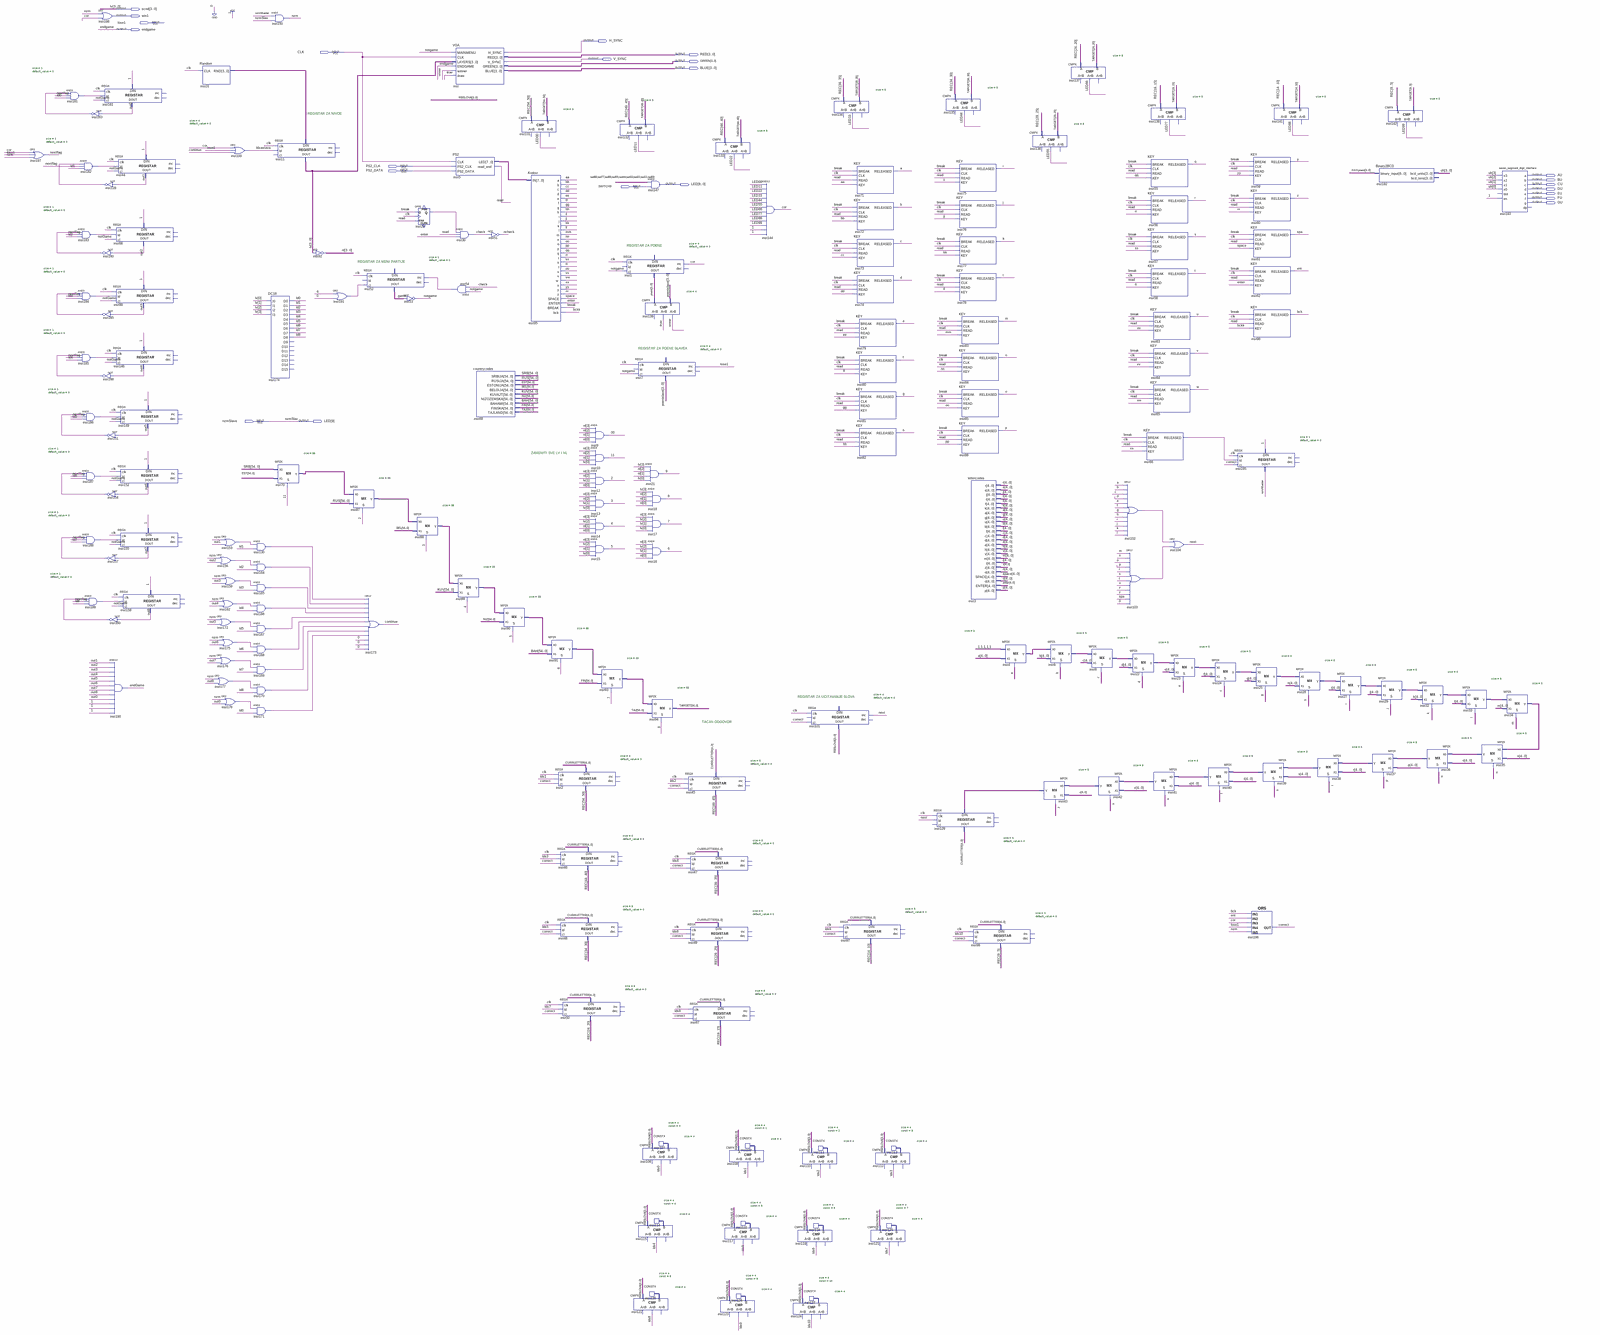
[diagram p0: schematic sheet, whole]
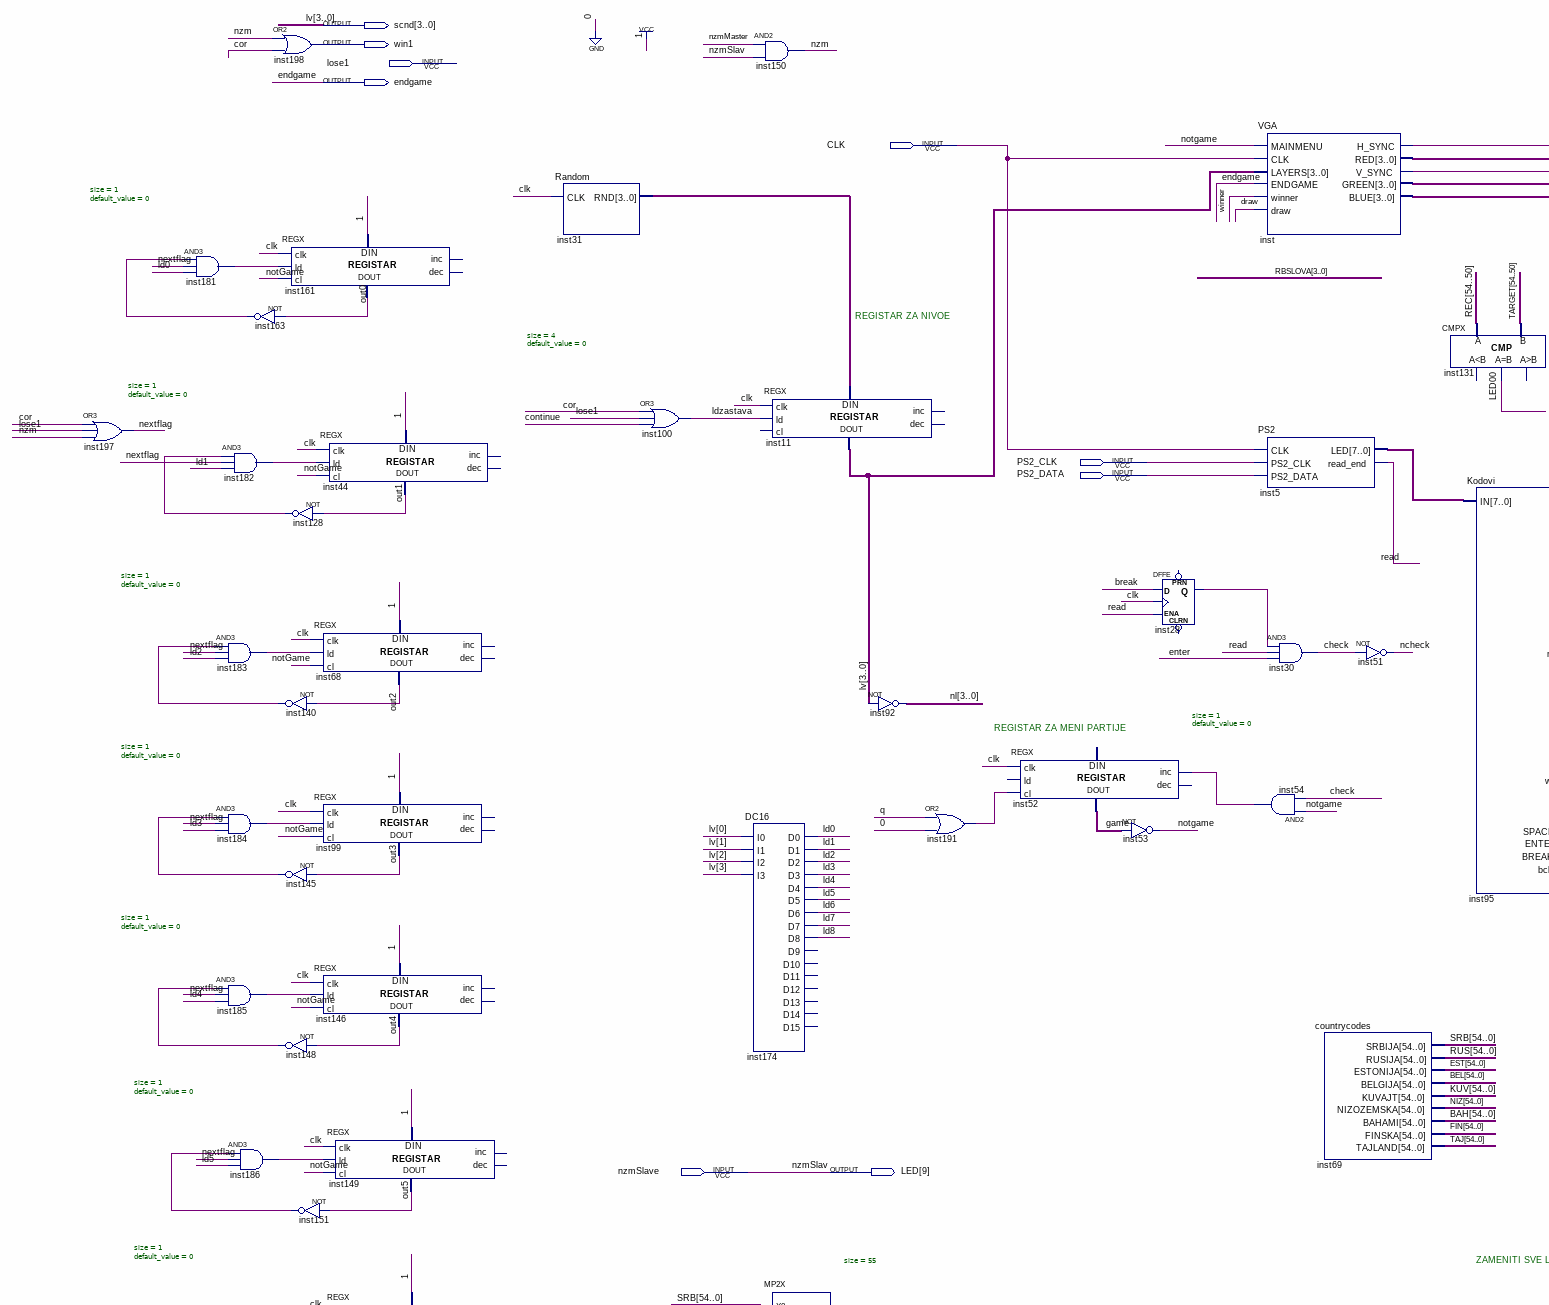
[diagram p1: schematic sheet, upper left part]
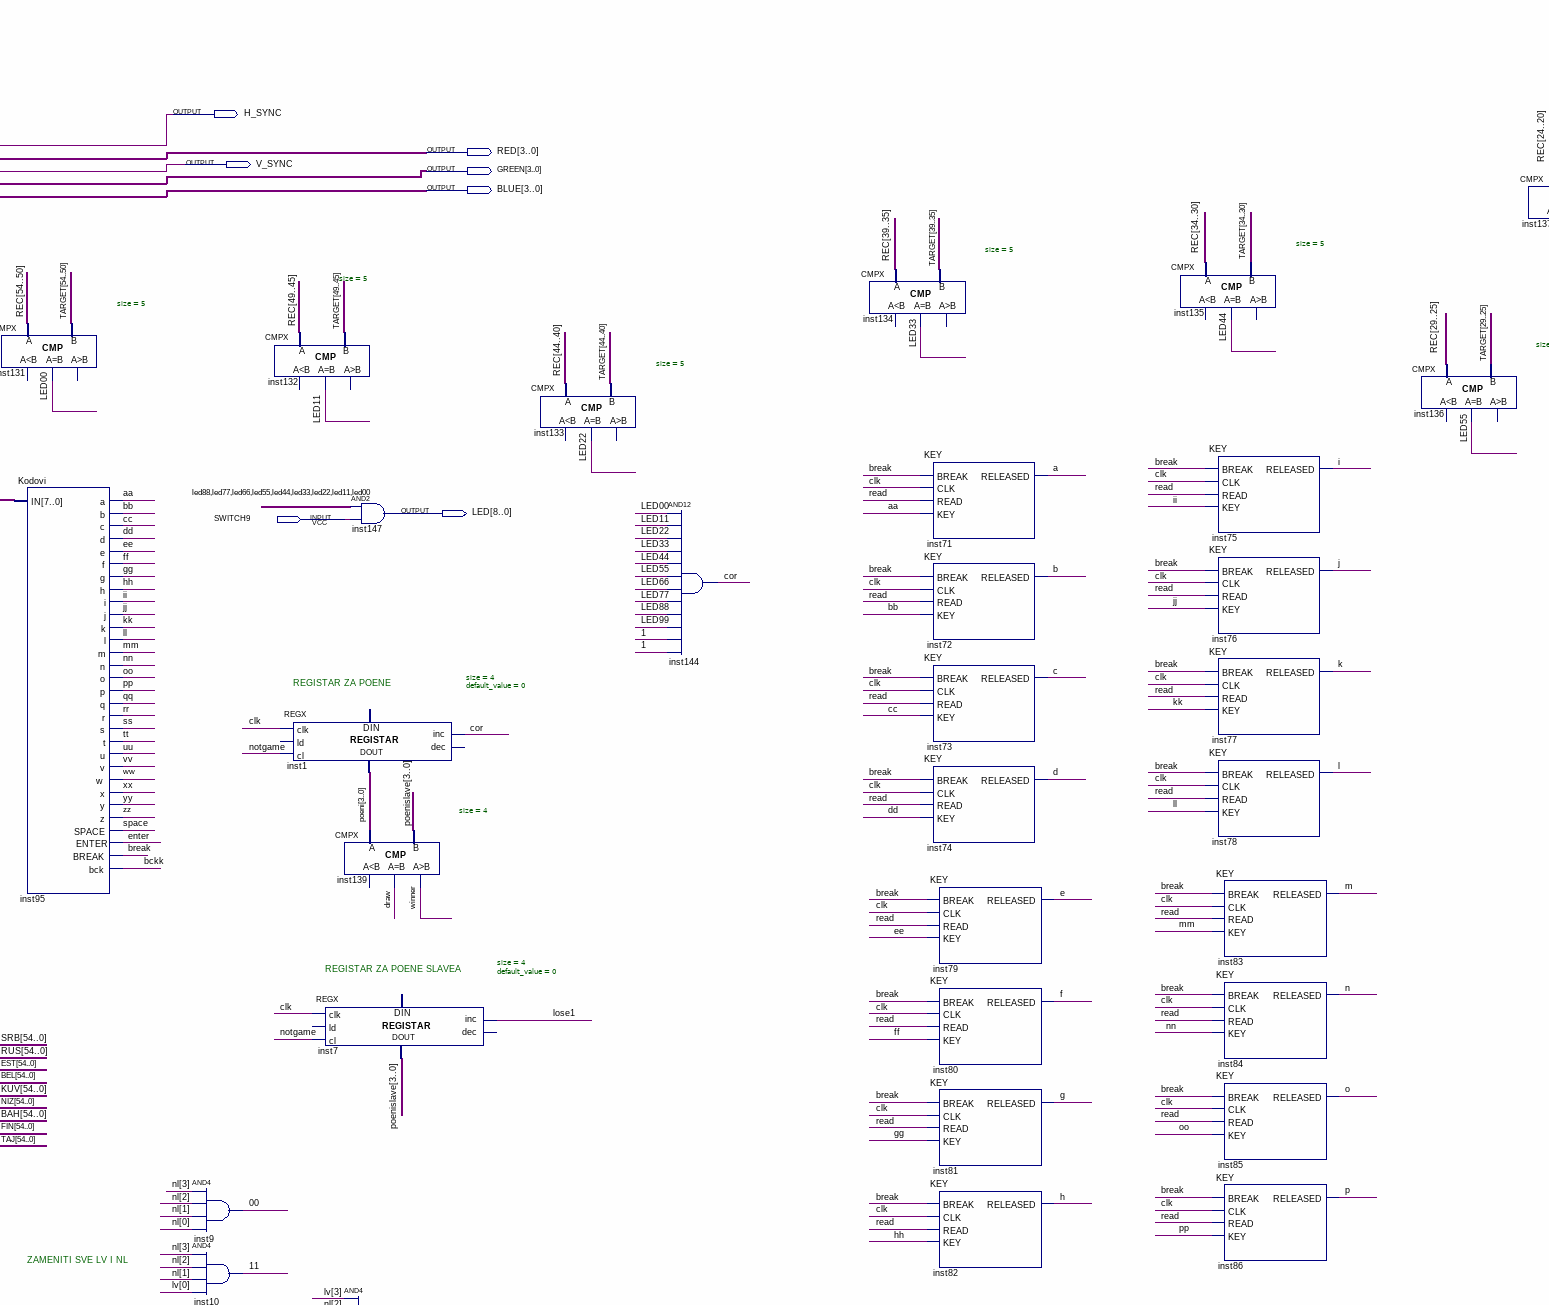
[diagram p2: schematic sheet, upper centre part]
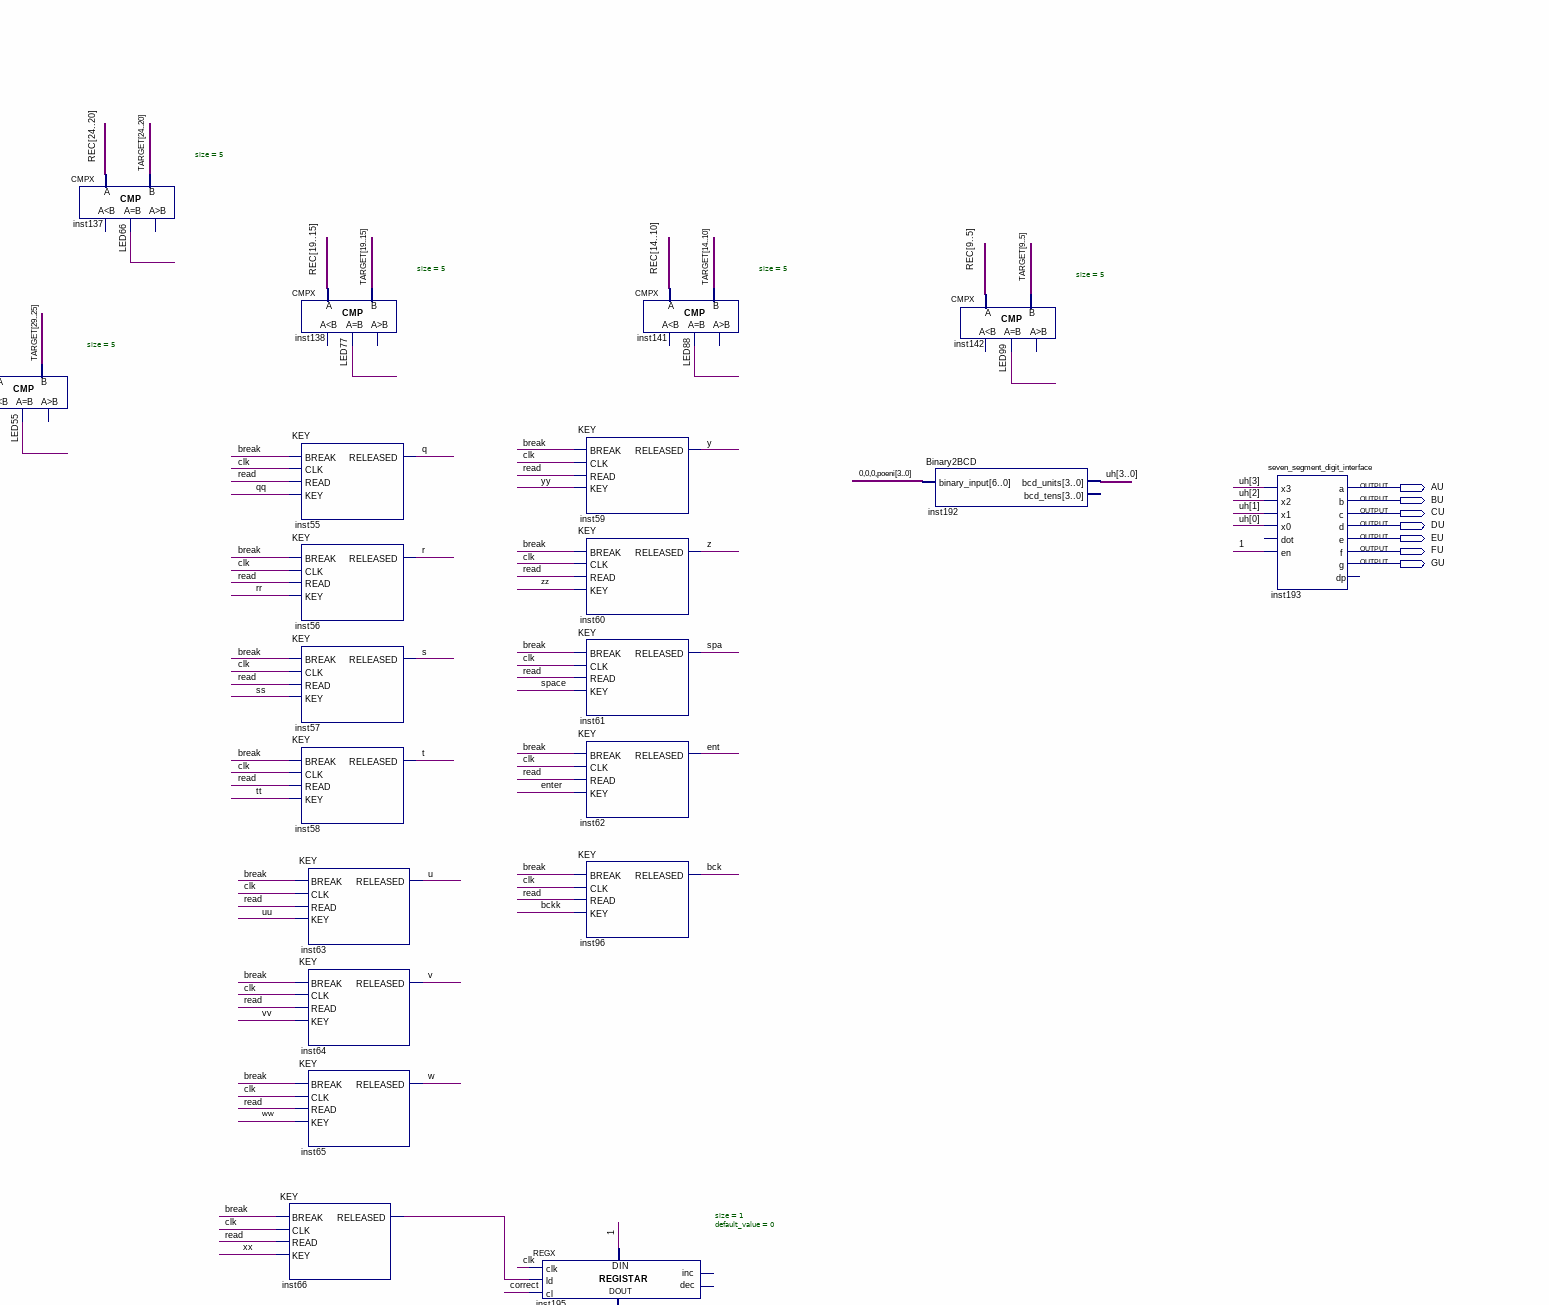
[diagram p3: schematic sheet, upper right part]
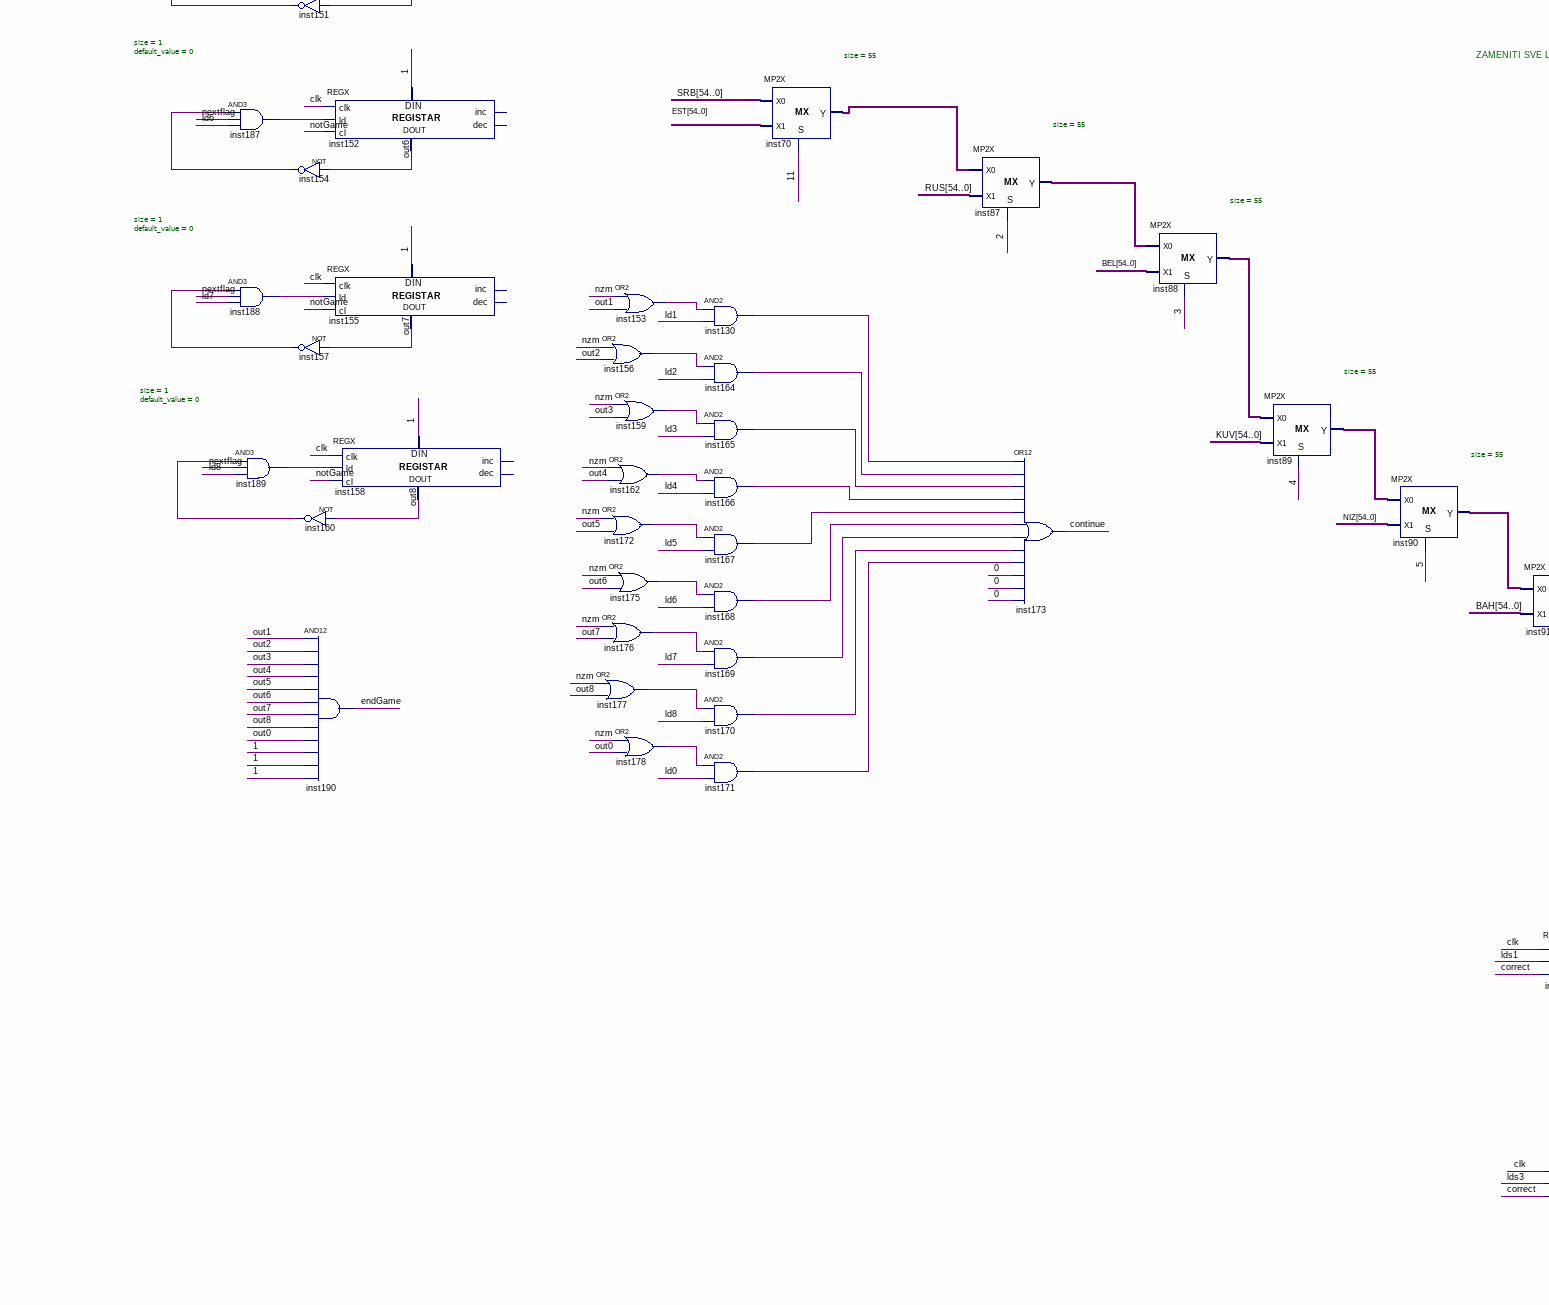
[diagram p4: schematic sheet, middle left part]
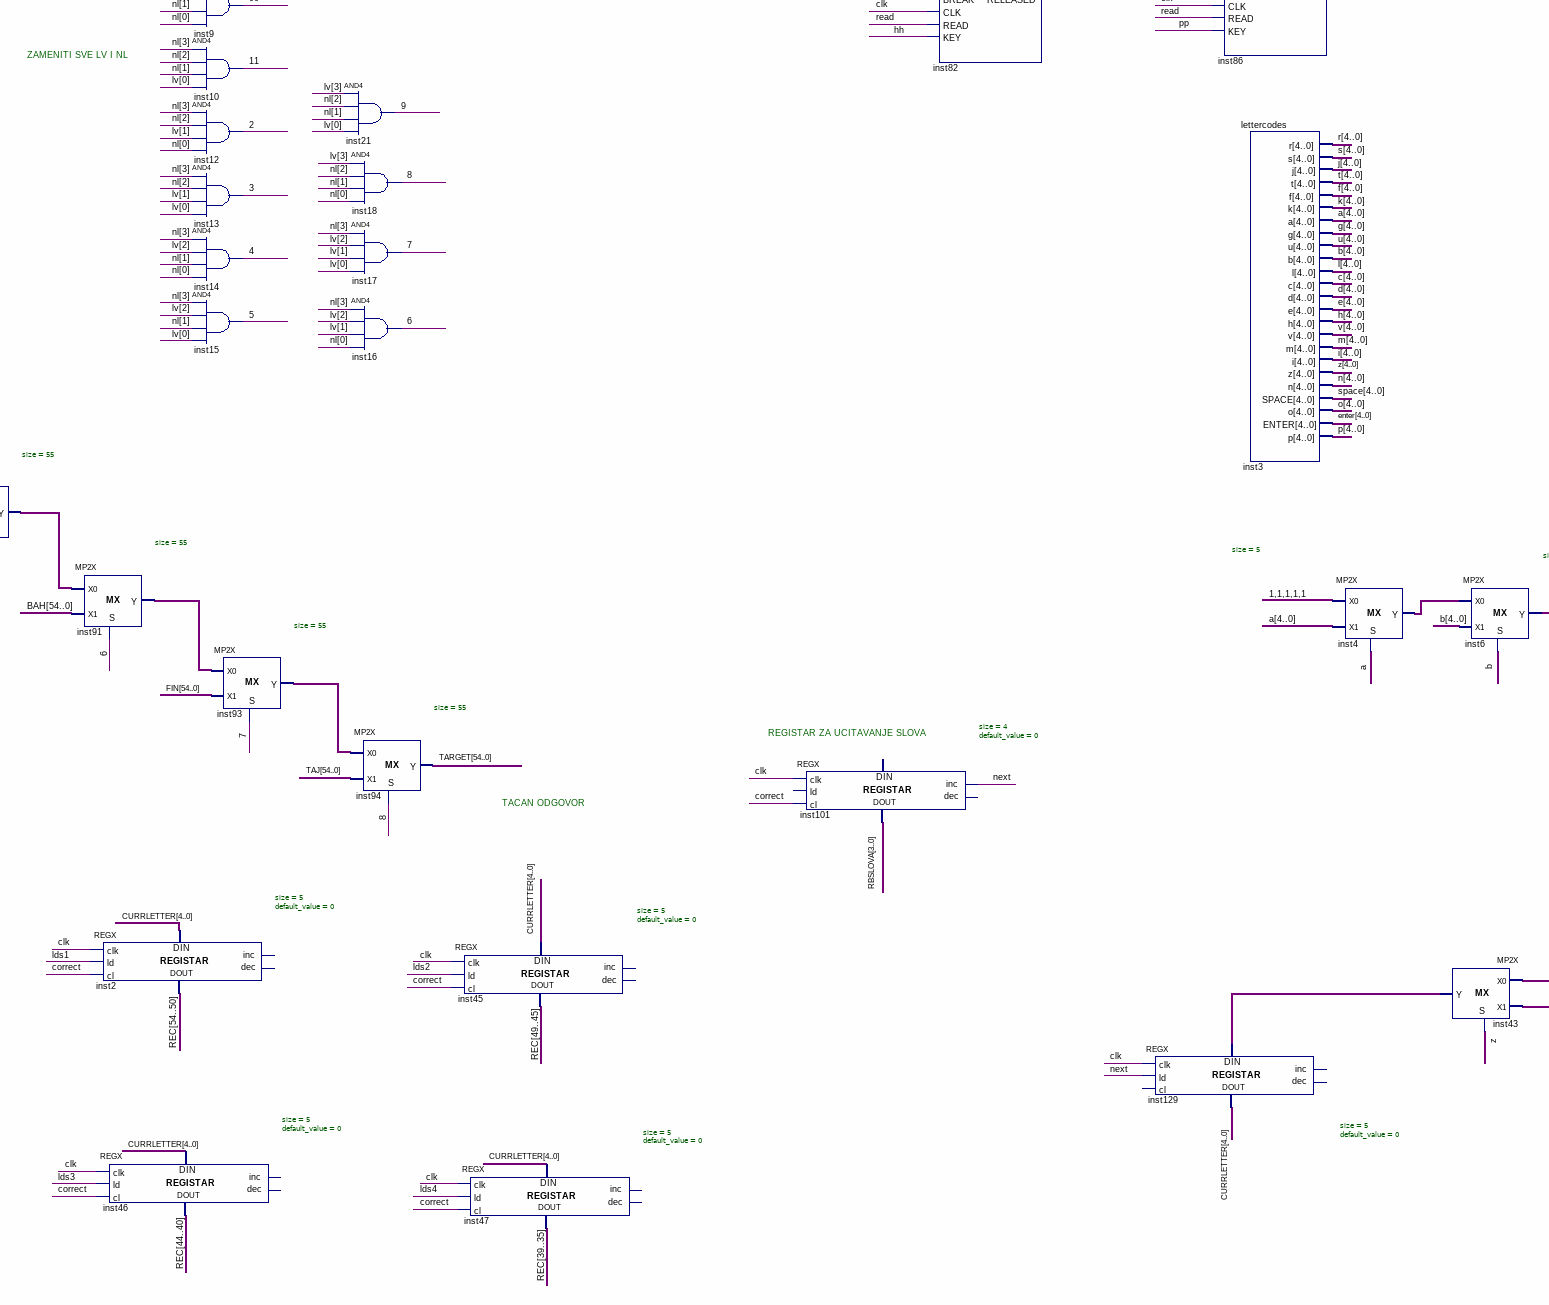
[diagram p5: schematic sheet, middle centre part]
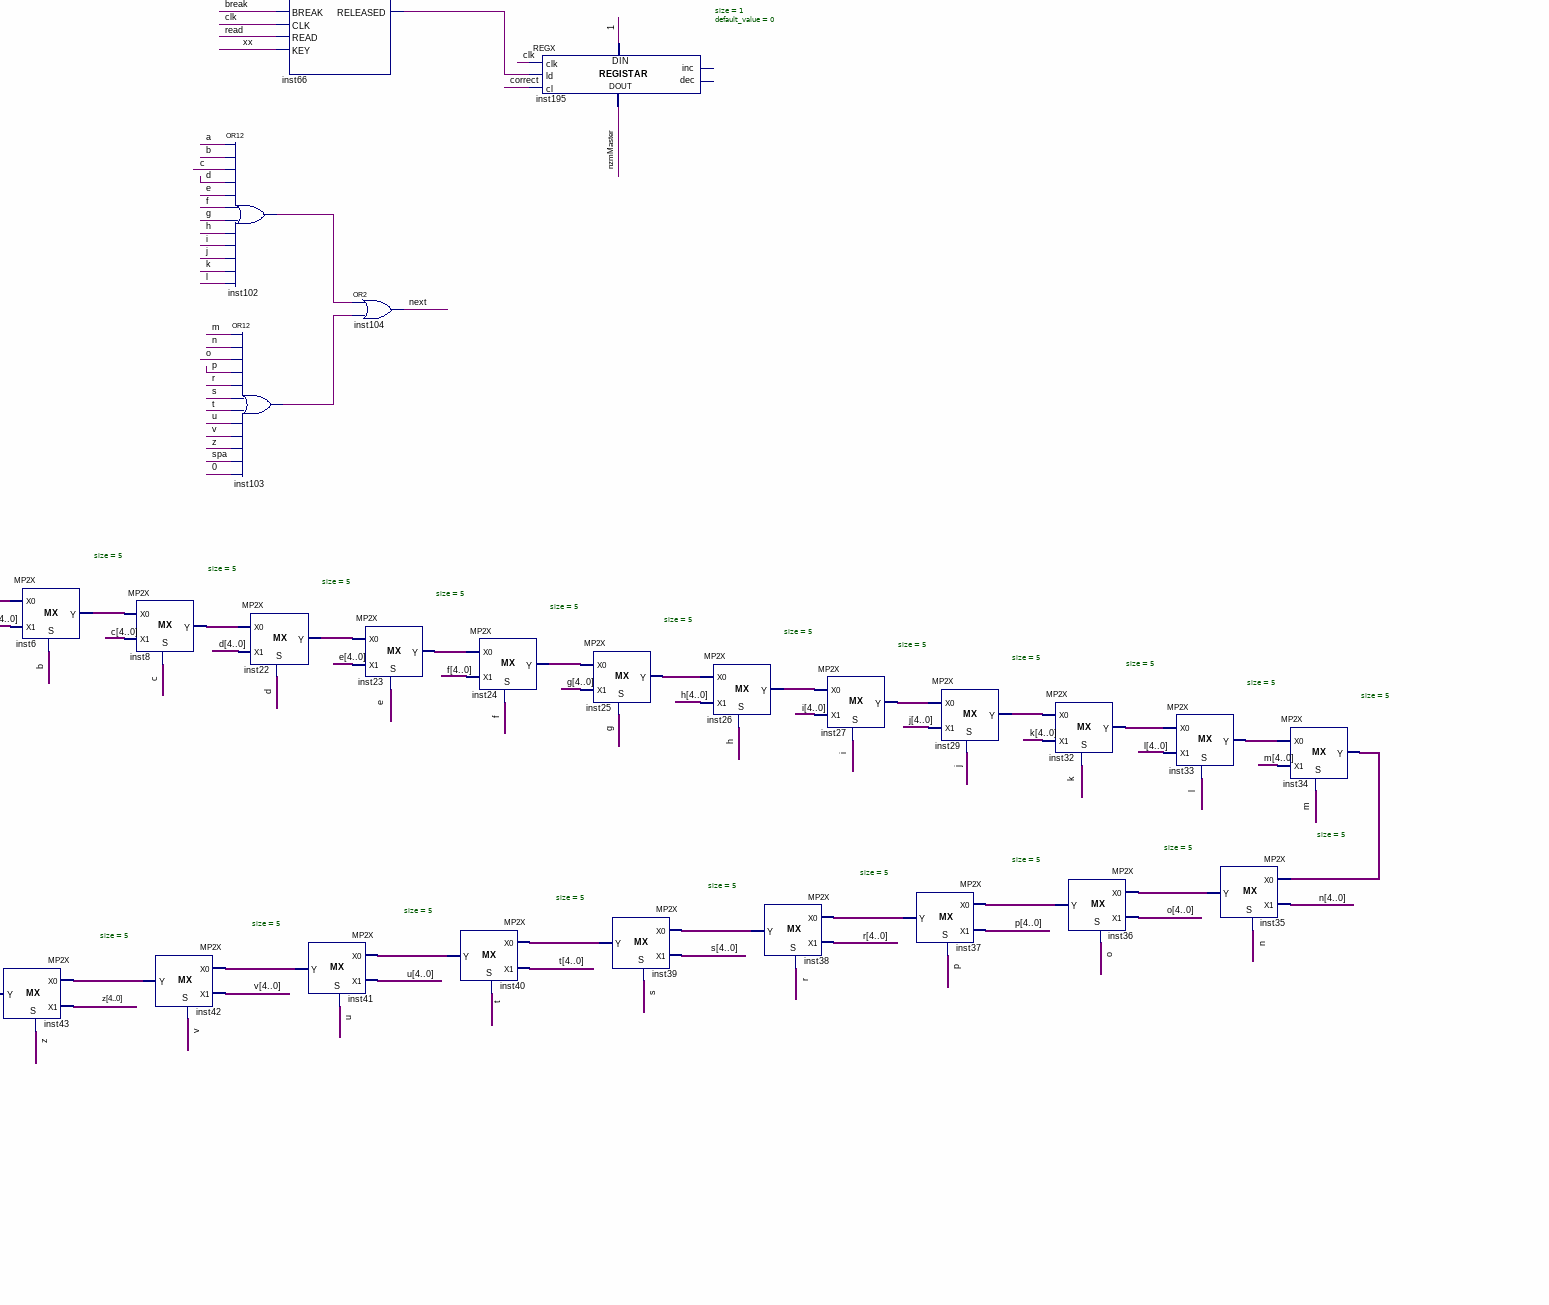
[diagram p6: schematic sheet, middle right part]
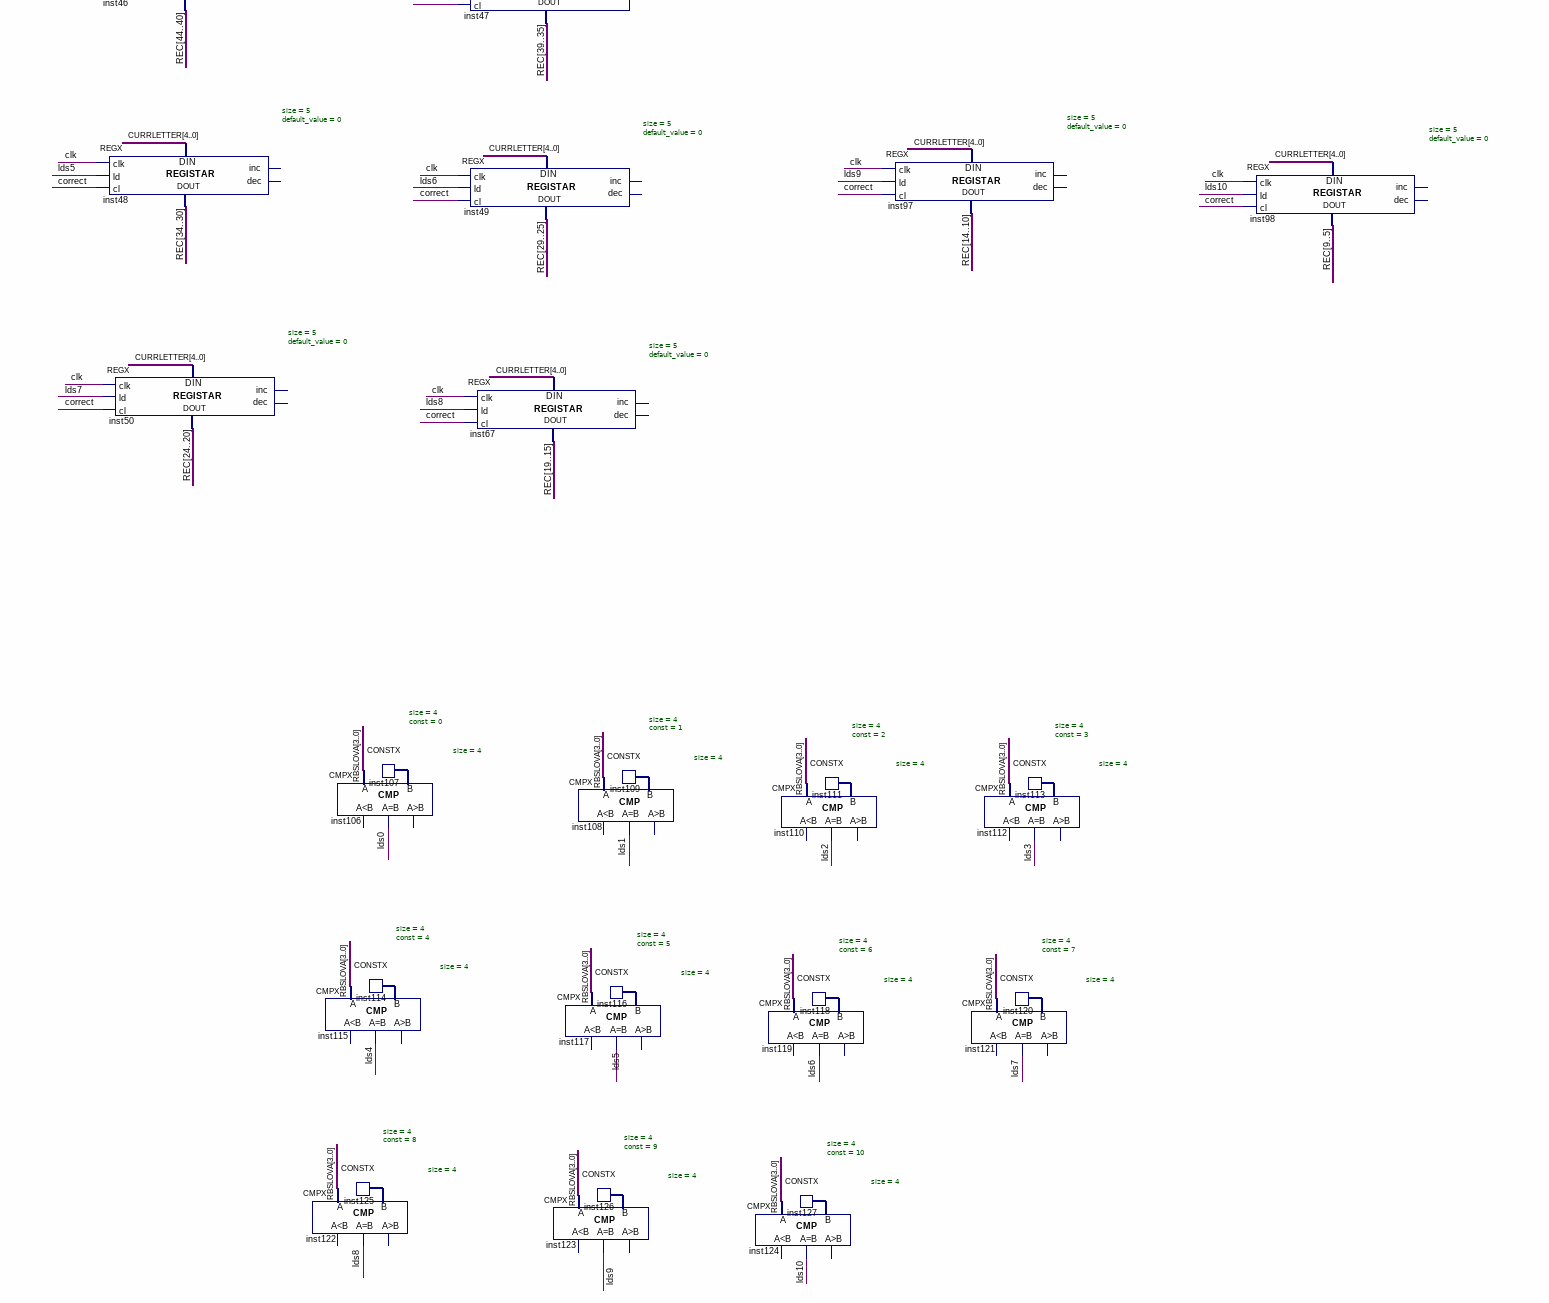
[diagram p7: schematic sheet, lower centre part]
// Quartus schematic FlagQuiz.bdf as structural Verilog: 192 symbols, 23 pins
module FlagQuiz (
  input  lose1,
  input  CLK,
  input  PS2_CLK,
  input  PS2_DATA,
  input  SWITCH9,
  input  nzmSlave,
  output [3:0] scnd,
  output win1,
  output endgame,
  output H_SYNC,
  output [3:0] RED,
  output V_SYNC,
  output [3:0] GREEN,
  output [3:0] BLUE,
  output AU,
  output BU,
  output [9:0] LED,
  output CU,
  output DU,
  output EU,
  output FU,
  output GU
);

  wire \00 , \2 , \3 , \4 , \5 , \6 , \7 , \8 , \9 , \11 , a_1bit, aa, b_1bit, bb, bck, bckk, \break ,
       c_1bit, cc, check, \continue , cor, correct, d_1bit, dd, draw, e_1bit, ee, ent, enter_1bit, f_1bit,
       ff, g_1bit, game, gg, h_1bit, hh, i_1bit, ii, inst28_q, inst54_out, inst66_released, inst102_out,
       inst103_out, inst128_out, inst130_out, inst140_out, inst145_out, inst148_out, inst151_out,
       inst153_out, inst154_out, inst156_out, inst157_out, inst159_out, inst160_out, inst162_out,
       inst163_out, inst164_out, inst165_out, inst166_out, inst167_out, inst168_out, inst169_out,
       inst170_out, inst171_out, inst172_out, inst175_out, inst176_out, inst177_out, inst178_out,
       inst181_out, inst182_out, inst183_out, inst184_out, inst185_out, inst186_out, inst187_out,
       inst188_out, inst189_out, inst191_out, j_1bit, jj, k_1bit, kk, l_1bit, ld0, ld1, ld2, ld3, ld4, ld5,
       ld6, ld7, ld8, lds0, lds1, lds2, lds3, lds4, lds5, lds6, lds7, lds8, lds9, lds10, ldzastava, LED00,
       LED11, LED22, LED33, LED44, LED55, LED66, LED77, LED88, LED99, ll, m_1bit, mm, n_1bit, ncheck, next,
       nextflag, nn, notgame, nzm, nzmMaster, o_1bit, oo, out0, out1, out2, out3, out4, out5, out6, out7,
       out8, p_1bit, pp, q, qq, r_1bit, read, rr, s_1bit, spa, space_1bit, ss, t_1bit, tt, u_1bit, uu,
       v_1bit, vv, w, winner, ww, xx, y, yy, z_1bit, zz;
  wire [3:0] inst31_rnd, inst107_data, inst109_data, inst111_data, inst113_data, inst114_data, inst116_data,
       inst118_data, inst120_data, inst125_data, inst126_data, inst127_data, nl, poeni, poenislave, RBSLOVA,
       uh;
  wire [4:0] a, b, c, CURRLETTER, d, e, enter, f, g, h, i, inst4_y, inst6_y, inst8_y, inst22_y, inst23_y,
       inst24_y, inst25_y, inst26_y, inst27_y, inst29_y, inst32_y, inst33_y, inst34_y, inst35_y, inst36_y,
       inst37_y, inst38_y, inst39_y, inst40_y, inst41_y, inst42_y, inst43_y, j, k, l, m, n, o, p, r, s,
       space, t, u, v, z;
  wire [7:0] inst5_led;
  wire [54:0] BAH, BEL, EST, FIN, inst70_y, inst87_y, inst88_y, inst89_y, inst90_y, inst91_y, inst93_y, KUV,
       NIZ, RUS, SRB, TAJ, TARGET;
  wire [54:5] REC;

  or inst197 (nextflag, cor, lose1, nzm);
  and inst181 (inst181_out, inst163_out, nextflag, ld0);
  not inst163 (inst163_out, out0);
  and inst182 (inst182_out, inst128_out, nextflag, ld1);
  and inst183 (inst183_out, inst140_out, nextflag, ld2);
  and inst184 (inst184_out, inst145_out, nextflag, ld3);
  and inst185 (inst185_out, inst148_out, nextflag, ld4);
  and inst186 (inst186_out, inst151_out, nextflag, ld5);
  and inst187 (inst187_out, inst154_out, nextflag, ld6);
  and inst188 (inst188_out, inst157_out, nextflag, ld7);
  and inst189 (inst189_out, inst160_out, nextflag, ld8);
  or inst198 (win1, nzm, cor);
  REGX #(.size(1), .default_value(0)) inst161 (
    .clk(CLK), .ld(inst181_out), .cl(notgame), .data_in(1'b1), .data_out(out0));  // open: inc, dec
  not inst128 (inst128_out, out1);
  not inst140 (inst140_out, out2);
  not inst145 (inst145_out, out3);
  not inst148 (inst148_out, out4);
  not inst151 (inst151_out, out5);
  not inst154 (inst154_out, out6);
  not inst157 (inst157_out, out7);
  not inst160 (inst160_out, out8);
  REGX #(.size(1), .default_value(0)) inst44 (
    .clk(CLK), .ld(inst182_out), .cl(notgame), .data_in(1'b1), .data_out(out1));  // open: inc, dec
  REGX #(.size(1), .default_value(0)) inst68 (
    .clk(CLK), .ld(inst183_out), .cl(notgame), .data_in(1'b1), .data_out(out2));  // open: inc, dec
  REGX #(.size(1), .default_value(0)) inst99 (
    .clk(CLK), .ld(inst184_out), .cl(notgame), .data_in(1'b1), .data_out(out3));  // open: inc, dec
  REGX #(.size(1), .default_value(0)) inst146 (
    .clk(CLK), .ld(inst185_out), .cl(notgame), .data_in(1'b1), .data_out(out4));  // open: inc, dec
  REGX #(.size(1), .default_value(0)) inst149 (
    .clk(CLK), .ld(inst186_out), .cl(notgame), .data_in(1'b1), .data_out(out5));  // open: inc, dec
  REGX #(.size(1), .default_value(0)) inst152 (
    .clk(CLK), .ld(inst187_out), .cl(notgame), .data_in(1'b1), .data_out(out6));  // open: inc, dec
  REGX #(.size(1), .default_value(0)) inst155 (
    .clk(CLK), .ld(inst188_out), .cl(notgame), .data_in(1'b1), .data_out(out7));  // open: inc, dec
  REGX #(.size(1), .default_value(0)) inst158 (
    .clk(CLK), .ld(inst189_out), .cl(notgame), .data_in(1'b1), .data_out(out8));  // open: inc, dec
  and inst190 (endgame, out1, out2, out3, out4, out5, out6, out7, out8, out0, 1'b1, 1'b1, 1'b1);
  Random inst31 (.CLK(CLK), .RND(inst31_rnd));
  or inst156 (inst156_out, nzm, out2);
  or inst172 (inst172_out, nzm, out5);
  or inst176 (inst176_out, nzm, out7);
  or inst177 (inst177_out, nzm, out8);
  or inst100 (ldzastava, cor, lose1, \continue );
  or inst153 (inst153_out, nzm, out1);
  or inst159 (inst159_out, nzm, out3);
  or inst162 (inst162_out, nzm, out4);
  or inst175 (inst175_out, nzm, out6);
  or inst178 (inst178_out, nzm, out0);
  and inst130 (inst130_out, inst153_out, ld1);
  and inst164 (inst164_out, inst156_out, ld2);
  and inst165 (inst165_out, inst159_out, ld3);
  and inst166 (inst166_out, inst162_out, ld4);
  and inst167 (inst167_out, inst172_out, ld5);
  and inst168 (inst168_out, inst175_out, ld6);
  and inst169 (inst169_out, inst176_out, ld7);
  and inst170 (inst170_out, inst177_out, ld8);
  and inst171 (inst171_out, inst178_out, ld0);
  and inst150 (nzm, nzmMaster, nzmSlave);
  DC16 inst174 (
    .I0(scnd[0]), .I1(scnd[1]), .I2(scnd[2]), .I3(scnd[3]), .D0(ld0), .D1(ld1), .D2(ld2), .D3(ld3), .D4(ld4),
    .D5(ld5), .D6(ld6), .D7(ld7), .D8(ld8));  // open: D9, D10, D11, D12, D13, D14, D15
  REGX #(.size(4), .default_value(0)) inst11 (
    .clk(CLK), .ld(ldzastava), .data_in(inst31_rnd), .data_out(scnd));  // open: cl, inc, dec
  MP2X #(.size(55)) inst70 (.S(\11 ), .X0(SRB), .X1(EST), .Y(inst70_y));
  assign nl = ~scnd;  // NOT inst92, 4 bits wide
  or inst191 (inst191_out, q, 1'b0);
  REGX #(.size(1), .default_value(0)) inst52 (
    .clk(CLK), .cl(inst191_out), .inc(inst54_out), .data_out(game));  // open: ld, dec, data_in
  MP2X #(.size(55)) inst87 (.S(\2 ), .X0(inst70_y), .X1(RUS), .Y(inst87_y));
  or inst173 (\continue , inst130_out, inst164_out, inst165_out, inst166_out, inst167_out, inst168_out, inst169_out, inst170_out, inst171_out, 1'b0, 1'b0, 1'b0);
  DFFE inst28 (.D(\break ), .CLK(CLK), .ENA(read), .Q(inst28_q));  // open: PRN, CLRN
  not inst53 (notgame, game);
  MP2X #(.size(55)) inst88 (.S(\3 ), .X0(inst87_y), .X1(BEL), .Y(inst88_y));
  VGA inst (
    .MAINMENU(notgame), .CLK(CLK), .LAYERS(scnd), .ENDGAME(endgame), .winner(winner), .draw(draw),
    .H_SYNC(H_SYNC), .RED(RED), .V_SYNC(V_SYNC), .GREEN(GREEN), .BLUE(BLUE));
  PS2 inst5 (.CLK(CLK), .PS2_CLK(PS2_CLK), .PS2_DATA(PS2_DATA), .LED(inst5_led), .read_end(read));
  and inst54 (inst54_out, notgame, check);
  MP2X #(.size(55)) inst89 (.S(\4 ), .X0(inst88_y), .X1(KUV), .Y(inst89_y));
  and inst30 (check, inst28_q, read, enter_1bit);
  countrycodes inst69 (
    .SRBIJA(SRB), .RUSIJA(RUS), .ESTONIJA(EST), .BELGIJA(BEL), .KUVAJT(KUV), .NIZOZEMSKA(NIZ), .BAHAMI(BAH),
    .FINSKA(FIN), .TAJLAND(TAJ));
  not inst51 (ncheck, check);
  MP2X #(.size(55)) inst90 (.S(\5 ), .X0(inst89_y), .X1(NIZ), .Y(inst90_y));
  CMPX #(.size(5)) inst131 (.A(REC[54:50]), .B(TARGET[54:50]), .eq(LED00));  // open: ls, gr
  Kodovi inst95 (
    .IN(inst5_led), .a(aa), .b(bb), .c(cc), .d(dd), .e(ee), .f(ff), .g(gg), .h(hh), .i(ii), .j(jj), .k(kk),
    .l(ll), .m(mm), .n(nn), .o(oo), .p(pp), .q(qq), .r(rr), .s(ss), .t(tt), .u(uu), .v(vv), .w(ww), .x(xx),
    .y(yy), .z(zz), .SPACE(space_1bit), .ENTER(enter_1bit), .BREAK(\break ), .bck(bckk));
  MP2X #(.size(55)) inst91 (.S(\6 ), .X0(inst90_y), .X1(BAH), .Y(inst91_y));
  REGX #(.size(5), .default_value(0)) inst2 (
    .clk(CLK), .ld(lds1), .cl(correct), .data_in(CURRLETTER), .data_out(REC[54:50]));  // open: inc, dec
  REGX #(.size(5), .default_value(0)) inst46 (
    .clk(CLK), .ld(lds3), .cl(correct), .data_in(CURRLETTER), .data_out(REC[44:40]));  // open: inc, dec
  REGX #(.size(5), .default_value(0)) inst48 (
    .clk(CLK), .ld(lds5), .cl(correct), .data_in(CURRLETTER), .data_out(REC[34:30]));  // open: inc, dec
  REGX #(.size(5), .default_value(0)) inst50 (
    .clk(CLK), .ld(lds7), .cl(correct), .data_in(CURRLETTER), .data_out(REC[24:20]));  // open: inc, dec
  and inst9 (\00 , nl[3], nl[2], nl[1], nl[0]);
  and inst10 (\11 , nl[3], nl[2], nl[1], scnd[0]);
  and inst12 (\2 , nl[3], nl[2], scnd[1], nl[0]);
  and inst13 (\3 , nl[3], nl[2], scnd[1], scnd[0]);
  and inst14 (\4 , nl[3], scnd[2], nl[1], nl[0]);
  and inst15 (\5 , nl[3], scnd[2], nl[1], scnd[0]);
  MP2X #(.size(55)) inst93 (.S(\7 ), .X0(inst91_y), .X1(FIN), .Y(inst93_y));
  CMPX #(.size(5)) inst132 (.A(REC[49:45]), .B(TARGET[49:45]), .eq(LED11));  // open: ls, gr
  REGX #(.size(4), .default_value(0)) inst1 (
    .clk(CLK), .cl(notgame), .inc(cor), .data_out(poeni));  // open: ld, dec, data_in
  REGX #(.size(4), .default_value(0)) inst7 (
    .clk(CLK), .cl(notgame), .inc(lose1), .data_out(poenislave));  // open: ld, dec, data_in
  CMPX #(.size(4)) inst115 (.A(RBSLOVA), .B(inst114_data), .eq(lds4));  // open: ls, gr
  CMPX #(.size(4)) inst122 (.A(RBSLOVA), .B(inst125_data), .eq(lds8));  // open: ls, gr
  assign LED[8:0] = {LED88, LED77, LED66, LED55, LED44, LED33, LED22, LED11, LED00} & {9{SWITCH9}};  // AND2 inst147, 9 bits wide
  CMPX #(.size(4)) inst139 (.A(poeni), .B(poenislave), .eq(draw), .gr(winner));  // open: ls
  and inst21 (\9 , scnd[3], nl[2], nl[1], scnd[0]);
  and inst18 (\8 , scnd[3], nl[2], nl[1], nl[0]);
  and inst17 (\7 , nl[3], scnd[2], scnd[1], scnd[0]);
  and inst16 (\6 , nl[3], scnd[2], scnd[1], nl[0]);
  MP2X #(.size(55)) inst94 (.S(\8 ), .X0(inst93_y), .X1(TAJ), .Y(TARGET));
  CONSTX #(.size(4), .\const (0)) inst107 (.data(inst107_data));
  CMPX #(.size(4)) inst106 (.A(RBSLOVA), .B(inst107_data), .eq(lds0));  // open: ls, gr
  CONSTX #(.size(4), .\const (4)) inst114 (.data(inst114_data));
  CONSTX #(.size(4), .\const (8)) inst125 (.data(inst125_data));
  REGX #(.size(5), .default_value(0)) inst45 (
    .clk(CLK), .ld(lds2), .cl(correct), .data_in(CURRLETTER), .data_out(REC[49:45]));  // open: inc, dec
  REGX #(.size(5), .default_value(0)) inst47 (
    .clk(CLK), .ld(lds4), .cl(correct), .data_in(CURRLETTER), .data_out(REC[39:35]));  // open: inc, dec
  REGX #(.size(5), .default_value(0)) inst49 (
    .clk(CLK), .ld(lds6), .cl(correct), .data_in(CURRLETTER), .data_out(REC[29:25]));  // open: inc, dec
  REGX #(.size(5), .default_value(0)) inst67 (
    .clk(CLK), .ld(lds8), .cl(correct), .data_in(CURRLETTER), .data_out(REC[19:15]));  // open: inc, dec
  CMPX #(.size(5)) inst133 (.A(REC[44:40]), .B(TARGET[44:40]), .eq(LED22));  // open: ls, gr
  CMPX #(.size(4)) inst108 (.A(RBSLOVA), .B(inst109_data), .eq(lds1));  // open: ls, gr
  CMPX #(.size(4)) inst117 (.A(RBSLOVA), .B(inst116_data), .eq(lds5));  // open: ls, gr
  CMPX #(.size(4)) inst123 (.A(RBSLOVA), .B(inst126_data), .eq(lds9));  // open: ls, gr
  CONSTX #(.size(4), .\const (1)) inst109 (.data(inst109_data));
  CONSTX #(.size(4), .\const (5)) inst116 (.data(inst116_data));
  CONSTX #(.size(4), .\const (9)) inst126 (.data(inst126_data));
  and inst144 (cor, LED00, LED11, LED22, LED33, LED44, LED55, LED66, LED77, LED88, LED99, 1'b1, 1'b1);
  CMPX #(.size(4)) inst110 (.A(RBSLOVA), .B(inst111_data), .eq(lds2));  // open: ls, gr
  CMPX #(.size(4)) inst119 (.A(RBSLOVA), .B(inst118_data), .eq(lds6));  // open: ls, gr
  CMPX #(.size(4)) inst124 (.A(RBSLOVA), .B(inst127_data), .eq(lds10));  // open: ls, gr
  REGX #(.size(4), .default_value(0)) inst101 (
    .clk(CLK), .cl(correct), .inc(next), .data_out(RBSLOVA));  // open: ld, dec, data_in
  CONSTX #(.size(4), .\const (2)) inst111 (.data(inst111_data));
  CONSTX #(.size(4), .\const (6)) inst118 (.data(inst118_data));
  CONSTX #(.size(4), .\const (10)) inst127 (.data(inst127_data));
  CMPX #(.size(5)) inst134 (.A(REC[39:35]), .B(TARGET[39:35]), .eq(LED33));  // open: ls, gr
  KEY inst71 (.BREAK(\break ), .CLK(CLK), .READ(read), .KEY(aa), .RELEASED(a_1bit));
  KEY inst72 (.BREAK(\break ), .CLK(CLK), .READ(read), .KEY(bb), .RELEASED(b_1bit));
  KEY inst73 (.BREAK(\break ), .CLK(CLK), .READ(read), .KEY(cc), .RELEASED(c_1bit));
  KEY inst74 (.BREAK(\break ), .CLK(CLK), .READ(read), .KEY(dd), .RELEASED(d_1bit));
  KEY inst79 (.BREAK(\break ), .CLK(CLK), .READ(read), .KEY(ee), .RELEASED(e_1bit));
  KEY inst80 (.BREAK(\break ), .CLK(CLK), .READ(read), .KEY(ff), .RELEASED(f_1bit));
  KEY inst81 (.BREAK(\break ), .CLK(CLK), .READ(read), .KEY(gg), .RELEASED(g_1bit));
  KEY inst82 (.BREAK(\break ), .CLK(CLK), .READ(read), .KEY(hh), .RELEASED(h_1bit));
  REGX #(.size(5), .default_value(0)) inst97 (
    .clk(CLK), .ld(lds9), .cl(correct), .data_in(CURRLETTER), .data_out(REC[14:10]));  // open: inc, dec
  CMPX #(.size(4)) inst112 (.A(RBSLOVA), .B(inst113_data), .eq(lds3));  // open: ls, gr
  CMPX #(.size(4)) inst121 (.A(RBSLOVA), .B(inst120_data), .eq(lds7));  // open: ls, gr
  CONSTX #(.size(4), .\const (3)) inst113 (.data(inst113_data));
  CONSTX #(.size(4), .\const (7)) inst120 (.data(inst120_data));
  CMPX #(.size(5)) inst135 (.A(REC[34:30]), .B(TARGET[34:30]), .eq(LED44));  // open: ls, gr
  REGX #(.size(5), .default_value(0)) inst129 (
    .clk(CLK), .ld(next), .data_in(inst43_y), .data_out(CURRLETTER));  // open: cl, inc, dec
  KEY inst75 (.BREAK(\break ), .CLK(CLK), .READ(read), .KEY(ii), .RELEASED(i_1bit));
  KEY inst76 (.BREAK(\break ), .CLK(CLK), .READ(read), .KEY(jj), .RELEASED(j_1bit));
  KEY inst77 (.BREAK(\break ), .CLK(CLK), .READ(read), .KEY(kk), .RELEASED(k_1bit));
  KEY inst78 (.BREAK(\break ), .CLK(CLK), .READ(read), .KEY(ll), .RELEASED(l_1bit));
  KEY inst83 (.BREAK(\break ), .CLK(CLK), .READ(read), .KEY(mm), .RELEASED(m_1bit));
  KEY inst84 (.BREAK(\break ), .CLK(CLK), .READ(read), .KEY(nn), .RELEASED(n_1bit));
  KEY inst85 (.BREAK(\break ), .CLK(CLK), .READ(read), .KEY(oo), .RELEASED(o_1bit));
  KEY inst86 (.BREAK(\break ), .CLK(CLK), .READ(read), .KEY(pp), .RELEASED(p_1bit));
  lettercodes inst3 (
    .r(r), .s(s), .j(j), .t(t), .f(f), .k(k), .a(a), .g(g), .u(u), .b(b), .l(l), .c(c), .d(d), .e(e), .h(h),
    .v(v), .m(m), .i(i), .z(z), .n(n), .SPACE(space), .o(o), .ENTER(enter), .p(p));
  REGX #(.size(5), .default_value(0)) inst98 (
    .clk(CLK), .ld(lds10), .cl(correct), .data_in(CURRLETTER), .data_out(REC[9:5]));  // open: inc, dec
  MP2X #(.size(5)) inst4 (.S(a_1bit), .X0({5{1'b1}}), .X1(a), .Y(inst4_y));
  CMPX #(.size(5)) inst136 (.A(REC[29:25]), .B(TARGET[29:25]), .eq(LED55));  // open: ls, gr
  MP2X #(.size(5)) inst6 (.S(b_1bit), .X0(inst4_y), .X1(b), .Y(inst6_y));
  MP2X #(.size(5)) inst43 (.S(z_1bit), .X0(inst42_y), .X1(z), .Y(inst43_y));
  CMPX #(.size(5)) inst137 (.A(REC[24:20]), .B(TARGET[24:20]), .eq(LED66));  // open: ls, gr
  MP2X #(.size(5)) inst8 (.S(c_1bit), .X0(inst6_y), .X1(c), .Y(inst8_y));
  MP2X #(.size(5)) inst42 (.S(v_1bit), .X0(inst41_y), .X1(v), .Y(inst42_y));
  or inst102 (inst102_out, a_1bit, b_1bit, c_1bit, d_1bit, e_1bit, f_1bit, g_1bit, h_1bit, i_1bit, j_1bit, k_1bit, l_1bit);
  or inst103 (inst103_out, m_1bit, n_1bit, o_1bit, p_1bit, r_1bit, s_1bit, t_1bit, u_1bit, v_1bit, z_1bit, spa, 1'b0);
  MP2X #(.size(5)) inst22 (.S(d_1bit), .X0(inst8_y), .X1(d), .Y(inst22_y));
  CMPX #(.size(5)) inst138 (.A(REC[19:15]), .B(TARGET[19:15]), .eq(LED77));  // open: ls, gr
  KEY inst55 (.BREAK(\break ), .CLK(CLK), .READ(read), .KEY(qq), .RELEASED(q));
  KEY inst56 (.BREAK(\break ), .CLK(CLK), .READ(read), .KEY(rr), .RELEASED(r_1bit));
  KEY inst57 (.BREAK(\break ), .CLK(CLK), .READ(read), .KEY(ss), .RELEASED(s_1bit));
  KEY inst58 (.BREAK(\break ), .CLK(CLK), .READ(read), .KEY(tt), .RELEASED(t_1bit));
  KEY inst66 (.BREAK(\break ), .CLK(CLK), .READ(read), .KEY(xx), .RELEASED(inst66_released));
  KEY inst63 (.BREAK(\break ), .CLK(CLK), .READ(read), .KEY(uu), .RELEASED(u_1bit));
  KEY inst64 (.BREAK(\break ), .CLK(CLK), .READ(read), .KEY(vv), .RELEASED(v_1bit));
  KEY inst65 (.BREAK(\break ), .CLK(CLK), .READ(read), .KEY(ww), .RELEASED(w));
  MP2X #(.size(5)) inst41 (.S(u_1bit), .X0(inst40_y), .X1(u), .Y(inst41_y));
  or inst104 (next, inst102_out, inst103_out);
  MP2X #(.size(5)) inst23 (.S(e_1bit), .X0(inst22_y), .X1(e), .Y(inst23_y));
  MP2X #(.size(5)) inst24 (.S(f_1bit), .X0(inst23_y), .X1(f), .Y(inst24_y));
  MP2X #(.size(5)) inst40 (.S(t_1bit), .X0(inst39_y), .X1(t), .Y(inst40_y));
  REGX #(.size(1), .default_value(0)) inst195 (
    .clk(CLK), .ld(inst66_released), .cl(correct), .data_in(1'b1), .data_out(nzmMaster));  // open: inc, dec
  KEY inst59 (.BREAK(\break ), .CLK(CLK), .READ(read), .KEY(yy), .RELEASED(y));
  KEY inst60 (.BREAK(\break ), .CLK(CLK), .READ(read), .KEY(zz), .RELEASED(z_1bit));
  KEY inst61 (.BREAK(\break ), .CLK(CLK), .READ(read), .KEY(space_1bit), .RELEASED(spa));
  KEY inst62 (.BREAK(\break ), .CLK(CLK), .READ(read), .KEY(enter_1bit), .RELEASED(ent));
  KEY inst96 (.BREAK(\break ), .CLK(CLK), .READ(read), .KEY(bckk), .RELEASED(bck));
  MP2X #(.size(5)) inst25 (.S(g_1bit), .X0(inst24_y), .X1(g), .Y(inst25_y));
  or inst196 (correct, bck, ent, cor, lose1, nzm);
  CMPX #(.size(5)) inst141 (.A(REC[14:10]), .B(TARGET[14:10]), .eq(LED88));  // open: ls, gr
  MP2X #(.size(5)) inst39 (.S(s_1bit), .X0(inst38_y), .X1(s), .Y(inst39_y));
  MP2X #(.size(5)) inst26 (.S(h_1bit), .X0(inst25_y), .X1(h), .Y(inst26_y));
  MP2X #(.size(5)) inst38 (.S(r_1bit), .X0(inst37_y), .X1(r), .Y(inst38_y));
  MP2X #(.size(5)) inst27 (.S(i_1bit), .X0(inst26_y), .X1(i), .Y(inst27_y));
  CMPX #(.size(5)) inst142 (.A(REC[9:5]), .B(TARGET[9:5]), .eq(LED99));  // open: ls, gr
  Binary2BCD inst192 (.binary_input({3'b000, poeni}), .bcd_units(uh));  // open: bcd_tens
  MP2X #(.size(5)) inst29 (.S(j_1bit), .X0(inst27_y), .X1(j), .Y(inst29_y));
  MP2X #(.size(5)) inst37 (.S(p_1bit), .X0(inst36_y), .X1(p), .Y(inst37_y));
  MP2X #(.size(5)) inst32 (.S(k_1bit), .X0(inst29_y), .X1(k), .Y(inst32_y));
  MP2X #(.size(5)) inst36 (.S(o_1bit), .X0(inst35_y), .X1(o), .Y(inst36_y));
  MP2X #(.size(5)) inst33 (.S(l_1bit), .X0(inst32_y), .X1(l), .Y(inst33_y));
  MP2X #(.size(5)) inst35 (.S(n_1bit), .X0(inst34_y), .X1(n), .Y(inst35_y));
  seven_segment_digit_interface inst193 (
    .x3(uh[3]), .x2(uh[2]), .x1(uh[1]), .x0(uh[0]), .en(1'b1), .a(AU), .b(BU), .c(CU), .d(DU), .e(EU),
    .f(FU), .g(GU));  // open: dot, dp
  MP2X #(.size(5)) inst34 (.S(m_1bit), .X0(inst33_y), .X1(m), .Y(inst34_y));

  assign LED[9] = nzmSlave;

  // Other names for the same wires on the sheet: lv[3:0] = scnd; nzmSlav = nzmSlave

  // Notes on the sheet:
  //   REGISTAR ZA NIVOE
  //   REGISTAR ZA POENE
  //   REGISTAR ZA MENI PARTIJE
  //   REGISTAR ZA POENE SLAVEA
  //   ZAMENITI SVE LV I NL
  //   REGISTAR ZA UCITAVANJE SLOVA
  //   TACAN ODGOVOR
endmodule
